# Altium schematic sheet Astavel and Monostable Clock Circuit - 1.0V_2021-10-04.schdoc
size 261 x 189 mm
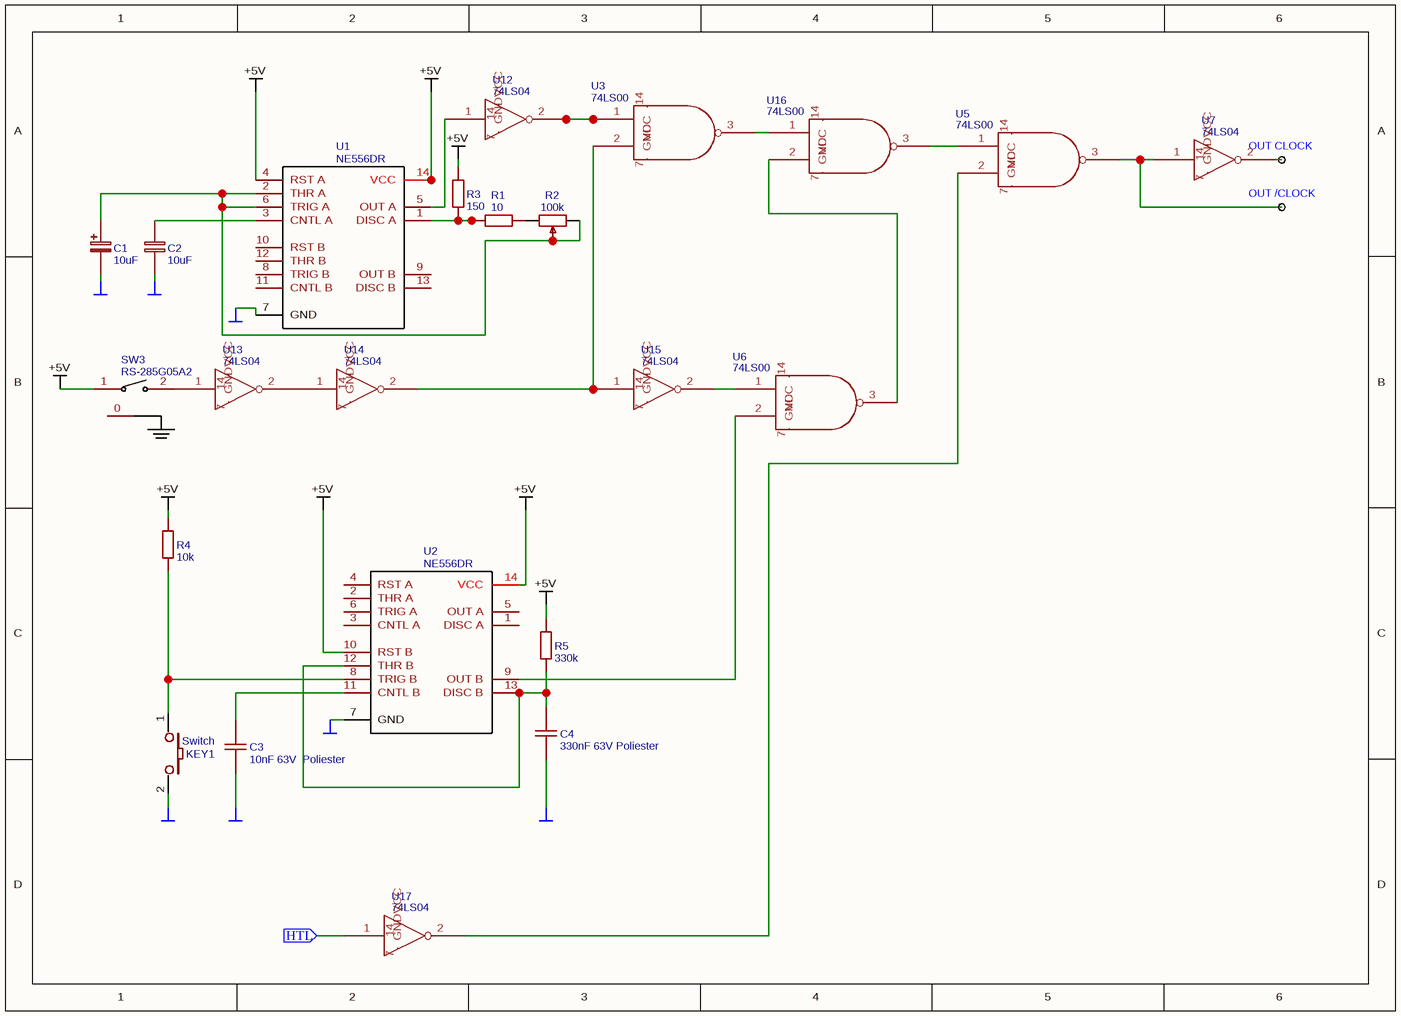
[diagram p0: Astavel and Monostable Clock Circuit - 1.0V_2021-10-04.schdoc]

## Parts
C1  10uF  [CAP-D3.0XF1.5]
C2  10uF  [RAD-0.1]
C3  10nF 63V  Poliester  [RAD-0.1]
C4  330nF 63V Poliester  [RAD-0.1]
KEY1  Switch  [KEY-3.0*4.0]
R1  10  [AXIAL-0.3]
R2  100k  [RES-ADJ_3386P]
R3  150  [AXIAL-0.3]
R4  10k  [AXIAL-0.3]
R5  330k  [AXIAL-0.3]
SW3  RS-285G05A2  [KEY-6.0X3.6X2.5MM]
U1  NE556DR  [SOIC-14_150MIL]
U2  NE556DR  [SOIC-14_150MIL]
U3  74LS00  [74LS04 DIP-14]
U5  74LS00  [74LS04 DIP-14]
U6  74LS00  [74LS04 DIP-14]
U7  74LS04  [74LS04 DIP-14]
U12  74LS04  [74LS04 DIP-14]
U13  74LS04  [74LS04 DIP-14]
U14  74LS04  [74LS04 DIP-14]
U15  74LS04  [74LS04 DIP-14]
U16  74LS00  [74LS04 DIP-14]
U17  74LS04  [74LS04 DIP-14]

## Ports
HTL (in)

## Nets
+5V: R3.1 R4.1 R5.1 SW3.1 U1.4(RST_A) U1.14(VCC) U2.10(RST_B) U2.14(VCC)
GND: C1.2 C2.2 C3.1 C4.1 KEY1.2 U1.7(GND) U2.7(GND)
HTL: U17.1 ; port HTL
NetC1_1: C1.1 R2.1 R2.2 U1.2(THR_A) U1.6(TRIG_A)
NetC2_1: C2.1 U1.3(CNTL_A)
NetC3_2: C3.2 U2.11(CNTL_B)
NetC4_2: C4.2 R5.2 U2.12(THR_B) U2.13(DISC_B)
NetKEY1_1: KEY1.1 R4.2 U2.8(TRIG_B)
NetR1_1: R1.1 R3.2 U1.1(DISC_A)
NetR1_2: R1.2 R2.3
NetSW3_2: SW3.2 U13.1
NetU1_5: U1.5(OUT_A) U12.1
NetU2_9: U2.9(OUT_B) U6.2
NetU3_1: U3.1 U12.2
NetU3_2: U3.2 U14.2 U15.1
NetU3_3: U3.3 U16.1
NetU5_1: U5.1 U16.3
NetU5_2: U5.2 U17.2
NetU5_3: U5.3 U7.1
NetU6_1: U6.1 U15.2
NetU6_3: U6.3 U16.2
NetU13_2: U13.2 U14.1

Not connected (* = marked no-connect by the designer): SW3 0; U1 8(TRIG_B) 9(OUT_B) 10(RST_B) 11(CNTL_B) 12(THR_B) 13(DISC_B); U2 1(DISC_A) 2(THR_A) 3(CNTL_A) 4(RST_A) 5(OUT_A) 6(TRIG_A); U3 7(GND) 14(VCC); U5 7(GND) 14(VCC); U6 7(GND) 14(VCC); U7 2 7(GND) 14(VCC); U12 7(GND) 14(VCC); U13 7(GND) 14(VCC); U14 7(GND) 14(VCC); U15 7(GND) 14(VCC); U16 7(GND) 14(VCC); U17 7(GND) 14(VCC)

## Notes on the sheet
- (near U7) OUT CLOCK
- (near U7) OUT /CLOCK

## Library data of the parts
C1 = 10uF: nameAlias: Value(F); Contributor: EasyEDA; BOM_Manufacturer Part: ?; spicePre: C; spiceSymbolName: Cap_Electrolytic(TH)_D3.0XF1.5_EU
C2 = 10uF: nameAlias: Value(F); BOM_Manufacturer Part: ?; spicePre: C; spiceSymbolName: Cap_RAD-0.1_EU
C3 = 10nF 63V  Poliester: nameAlias: Value(F); BOM_Manufacturer Part: ?; spicePre: C; spiceSymbolName: Cap_RAD-0.1_US
C4 = 330nF 63V Poliester: nameAlias: Value(F); BOM_Manufacturer Part: ?; spicePre: C; spiceSymbolName: Cap_RAD-0.1_US
KEY1 = Switch: BOM_Manufacturer: ReliaPro; BOM_Manufacturer Part: Switch3x4x2; Contributor: LCSC; BOM_Supplier: LCSC; BOM_Supplier Part: C26638; spicePre: K
R1 = 10: nameAlias: Value(Ω); BOM_Manufacturer Part: ?; spicePre: R; spiceSymbolName: Res_AXIAL-0.3(1/8W)_EU
R2 = 100k: BOM_Manufacturer: Bochen; BOM_Manufacturer Part: 3386P-1-101LF; nameAlias: Resistance(Ohms); BOM_Supplier Part: C125022; BOM_Supplier: LCSC; spicePre: R; spiceSymbolName: 3386P-1-101LF
R3 = 150: nameAlias: Value(Ω); BOM_Manufacturer Part: ?; spicePre: R; spiceSymbolName: Res_AXIAL-0.3(1/8W)_EU
R4 = 10k: nameAlias: Value(Ω); BOM_Manufacturer Part: ?; spicePre: R; spiceSymbolName: Res_AXIAL-0.3(1/8W)_EU
R5 = 330k: nameAlias: Value(Ω); BOM_Manufacturer Part: ?; spicePre: R; spiceSymbolName: Res_AXIAL-0.3(1/8W)_EU
SW3 = RS-285G05A2: BOM_Manufacturer: C&K; BOM_Manufacturer Part: RS-285G05A2-URT; Contributor: LCSC; BOM_Supplier: LCSC; BOM_Supplier Part: C221931; spicePre: S
U1 U2 = NE556DR: BOM_Manufacturer: TI; Contributor: LCSC; BOM_Supplier: LCSC; BOM_Manufacturer Part: NE556DR; image: //image.lceda.cn/szlcsc/C7427.jpg; BOM_Supplier Part: C7427; spicePre: U
U3 U5 U6 U16 = 74LS00: Contributor: KiCad; BOM_Manufacturer Part: ?; spicePre: U
U7 U12-U15 U17 = 74LS04: Contributor: KiCad; BOM_Manufacturer Part: ?; spicePre: U